# Altium project Monitoring_TECO.PrjPcb
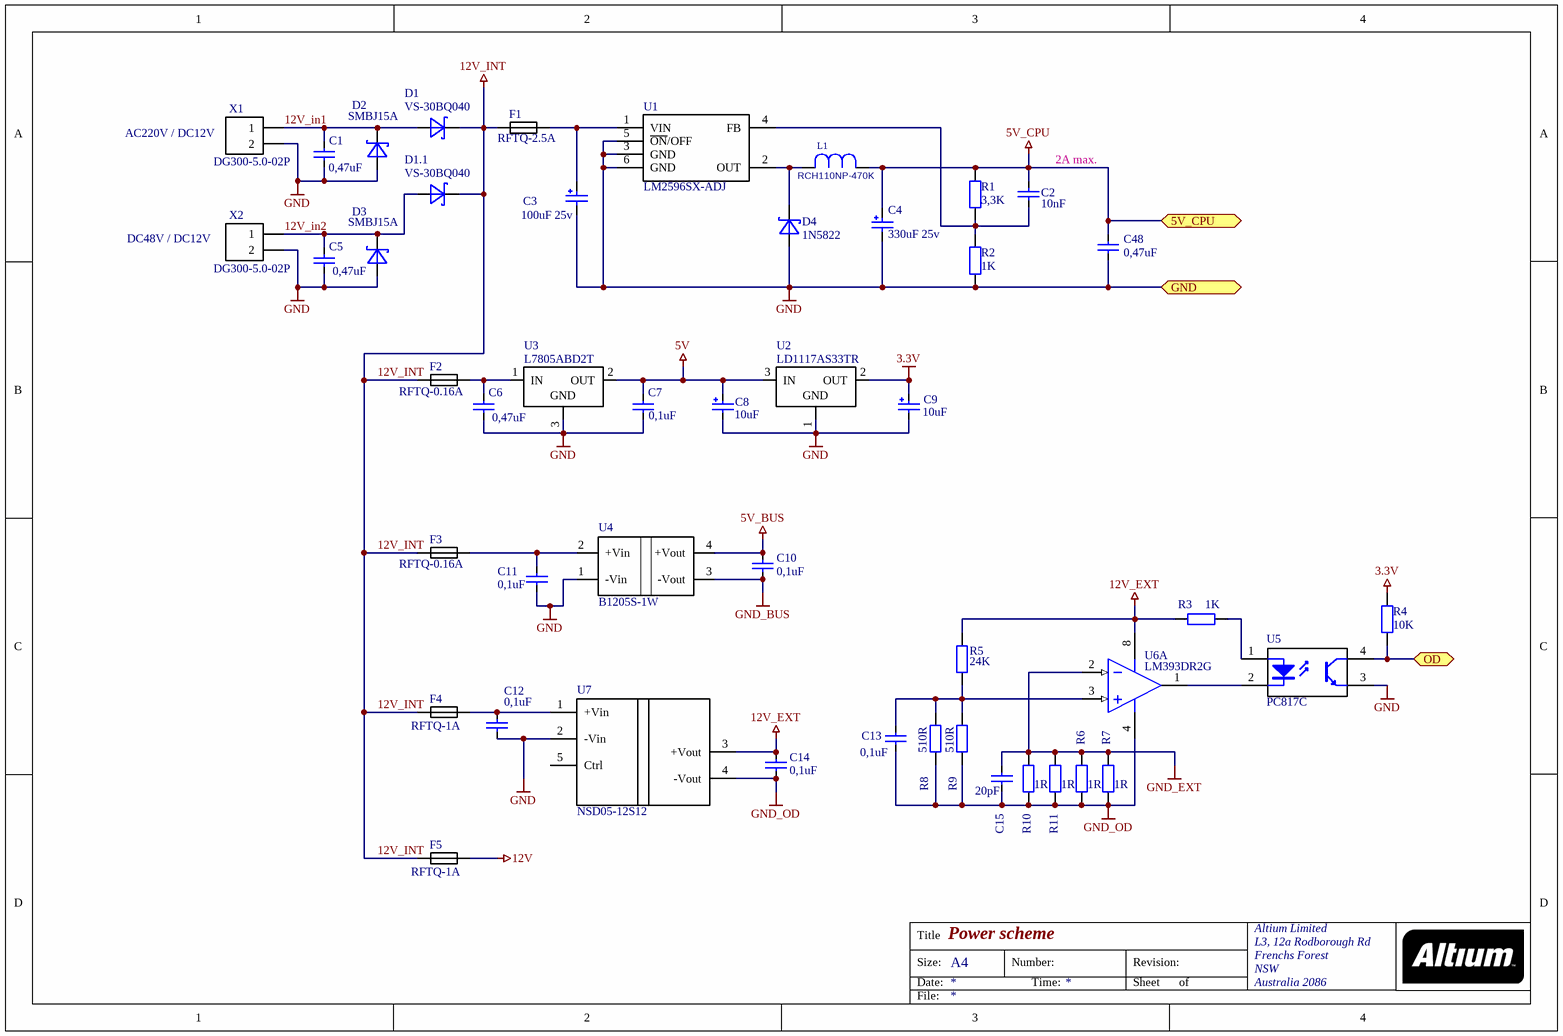
[diagram p0: Sheet_Power.SchDoc]
5 sheets, 222 parts. Net scope: global (net labels, ports and power ports of the same name join across sheets).
Board files: PCB_monitoring_IO.PcbDoc, PCB_monitoring_Top_Front.PcbDoc, PCB_monitoring_Bott_Back.PcbDoc, A10-OLinuXino-LIME.PcbDoc, PCB_monitoring_ConnectA10.PcbDoc
Sheets:
  Sheet_Power.SchDoc
  Sheet_MCU_IO.SchDoc
  Sheet_Top_Front.SchDoc
  Sheet_Bott_Back.SchDoc
  Sheet_ConnectA10.SchDoc

## Sheet Sheet_Power.SchDoc: Power scheme
size A4; Organization: Altium Limited; Address1: L3, 12a Rodborough Rd; Address2: Frenchs Forest; Address3: NSW; Address4: Australia 2086

### Parts
C1  value 0,47uF  [C_1206]  (hidden comment: Cap_Semi)
C2  value 10nF  [C_0805]  (hidden comment: Cap_Semi)
C3  value 100uF 25v  [8x11]  (hidden comment: Cap_Polar)
C4  value 330uF 25v  [10x16]  (hidden comment: Cap_Polar)
C5  value 0,47uF  [C_1206]  (hidden comment: Cap_Semi)
C6  value 0,47uF  [C_1206]  (hidden comment: Cap_Semi)
C7  value 0,1uF  [C_0805]  (hidden comment: Cap_Semi)
C8  value 10uF  [5x11]  (hidden comment: Cap_Polar)
C9  value 10uF  [5x11]  (hidden comment: Cap_Polar)
C10  value 0,1uF  [C_0805]  (hidden comment: Cap_Semi)
C11  value 0,1uF  [C_0805]  (hidden comment: Cap_Semi)
C12  value 0,1uF  [C_0805]  (hidden comment: Cap_Semi)
C13  value 0,1uF  [C_0805]  (hidden comment: Cap_Semi)
C14  value 0,1uF  [C_0805]  (hidden comment: Cap_Semi)
C15  value 20pF  [C_0805]  (hidden comment: Cap_Semi)
C48  value 0,47uF  [C_1206]  (hidden comment: Cap_Semi)
D1  VS-30BQ040  [SMC]
D1.1  VS-30BQ040  [SMC]
D2  SMBJ15A  [SMB]
D3  SMBJ15A  [SMB]
D4  1N5822  [DO-201]
F1  RFTQ-2.5A  [Fuse RFTQ]
F2  RFTQ-0.16A  [Fuse RFTQ]
F3  RFTQ-0.16A  [Fuse RFTQ]
F4  RFTQ-1A  [Fuse RFTQ]
F5  RFTQ-1A  [Fuse RFTQ]
L1  RCH110NP-470K  [RCH-110]
R1  value 3,3K  [R_0805]  (hidden comment: Resistor)
R2  value 1K  [R_0805]  (hidden comment: Resistor)
R3  value 1K  [R_0805]  (hidden comment: Resistor)
R4  value 10K  [R_0805]  (hidden comment: Resistor)
R5  value 24K  [R_0805]  (hidden comment: Resistor)
R6  value 1R  [R_1206]  (hidden comment: Resistor)
R7  value 1R  [R_1206]  (hidden comment: Resistor)
R8  value 510R  [R_0805]  (hidden comment: Resistor)
R9  value 510R  [R_0805]  (hidden comment: Resistor)
R10  value 1R  [R_1206]  (hidden comment: Resistor)
R11  value 1R  [R_1206]  (hidden comment: Resistor)
U1  LM2596SX-ADJ  [D2PAK_5p]
U2  LD1117AS33TR  [SOT-223_N]
U3  L7805ABD2T  [D2PAK_3p]
U4  B1205S-1W  [SIP4]
U5  PC817C  [DIP-4]
U6  LM393DR2G  [SO-8_L]  (part A of 2)
U7  NSD05-12S12  [NSD05]
X1  DG300-5.0-02P  [5mm 2]
X2  DG300-5.0-02P  [5mm 2]

### Ports
5V_CPU, GND, OD

### Nets
3.3V: C9.1 R4.2 U2.2(OUT)
5V: C7.2 C8.1 U2.3(IN) U3.2(OUT)
5V_BUS: C10.1 U4.4(+Vout)
5V_CPU: C2.1 C4.1 C48.2 L1.1 R1.2 ; port 5V_CPU
12V: F5.1
12V_EXT: C14.2 R3.1 R5.2 U6.8(VCC) U7.3(+Vout)
12V_INT: D1.2(C) D1.1.2(C) F1.2 F2.2 F3.2 F4.2 F5.2
GND: C1.1 C3.2 C4.2 C5.1 C6.1 C7.1 C8.2 C9.2 C11.2 C12.1 C48.1 D2.1(A) D3.1(A) D4.1(A) R2.1 U1.3(GND) U1.5(~{ON}/OFF) U1.6(GND) U2.1(GND) U3.3(GND) U4.1(-Vin) U5.3(E) U7.2(-Vin) X1.2 X2.2 ; port GND
GND_BUS: C10.2 U4.3(-Vout)
GND_EXT: C15.2 R6.2 R7.2 R10.2 R11.2 U6.2(INA-)
GND_OD: C13.1 C14.1 C15.1 R6.1 R7.1 R8.1 R9.1 R10.1 R11.1 U6.4(GND) U7.4(-Vout)
12V_in1: C1.2 D1.1(A) D2.2(C) X1.1
12V_in2: C5.2 D1.1.1(A) D3.2(C) X2.1
OD: R4.1 U5.4(C) ; port OD
NetC2_2: C2.2 R1.1 R2.2 U1.4(FB)
NetC3_1: C3.1 F1.1 U1.1(VIN)
NetC6_2: C6.2 F2.1 U3.1(IN)
NetC11_1: C11.1 F3.1 U4.2(+Vin)
NetC12_2: C12.2 F4.1 U7.1(+Vin)
NetC13_2: C13.2 R5.1 R8.2 R9.2 U6.3(INA+)
NetD4_2: D4.2(C) L1.2 U1.2(OUT)
NetR3_2: R3.2 U5.1(A)
NetU5_2: U5.2(K) U6.1(OUTA)

Not connected (* = marked no-connect by the designer): U7 5(Ctrl)

### Notes on the sheet
- (near X1) AC220V / DC12V
- (near C2) 2A max.
- DC48V / DC12V
- Title
- Size:
- Date:
- A4
- Number:
- Time:
- Revision:
- Sheet
- of
- File:

### Library data of the parts
C1 C2 C5-C7 C10-C15 C48 = Cap_Semi: Capacitor semi
C3 C4 = Cap_Polar: Capacitor Polar
C8 C9 = Capacitor Polar
D1 D1.1 = VS-30BQ040: Diode Schottky
D2 D3 = SMBJ13A: Supressor
D4 = 1N5822: Diode Schottky
F1-F5 = Fuse
L1 = Inductor: Value: RCH110NP-470K
U1 = LM2596SX-ADJ: Easy Switcher 3.0A Step-Down Voltage Regulator
U2 = LD1117AS33TR: Voltage Regulators 800mA
U3 = L7805ABD2T: Voltage Regulators
U4 = B0505S-1W: DC/DC converter
U5 = PC817: Optocoupler
U6 = LM393DR2G: Dual Comparators
U7 = NSD05-12S12: DC/DC Regulated Single Output
X1 X2 = DG300_2pin: Connector 5mm

## Sheet Sheet_MCU_IO.SchDoc: MCU and I/O scheme
size A3; Organization: Altium Limited; Address1: L3, 12a Rodborough Rd; Address2: Frenchs Forest; Address3: NSW; Address4: Australia 2086
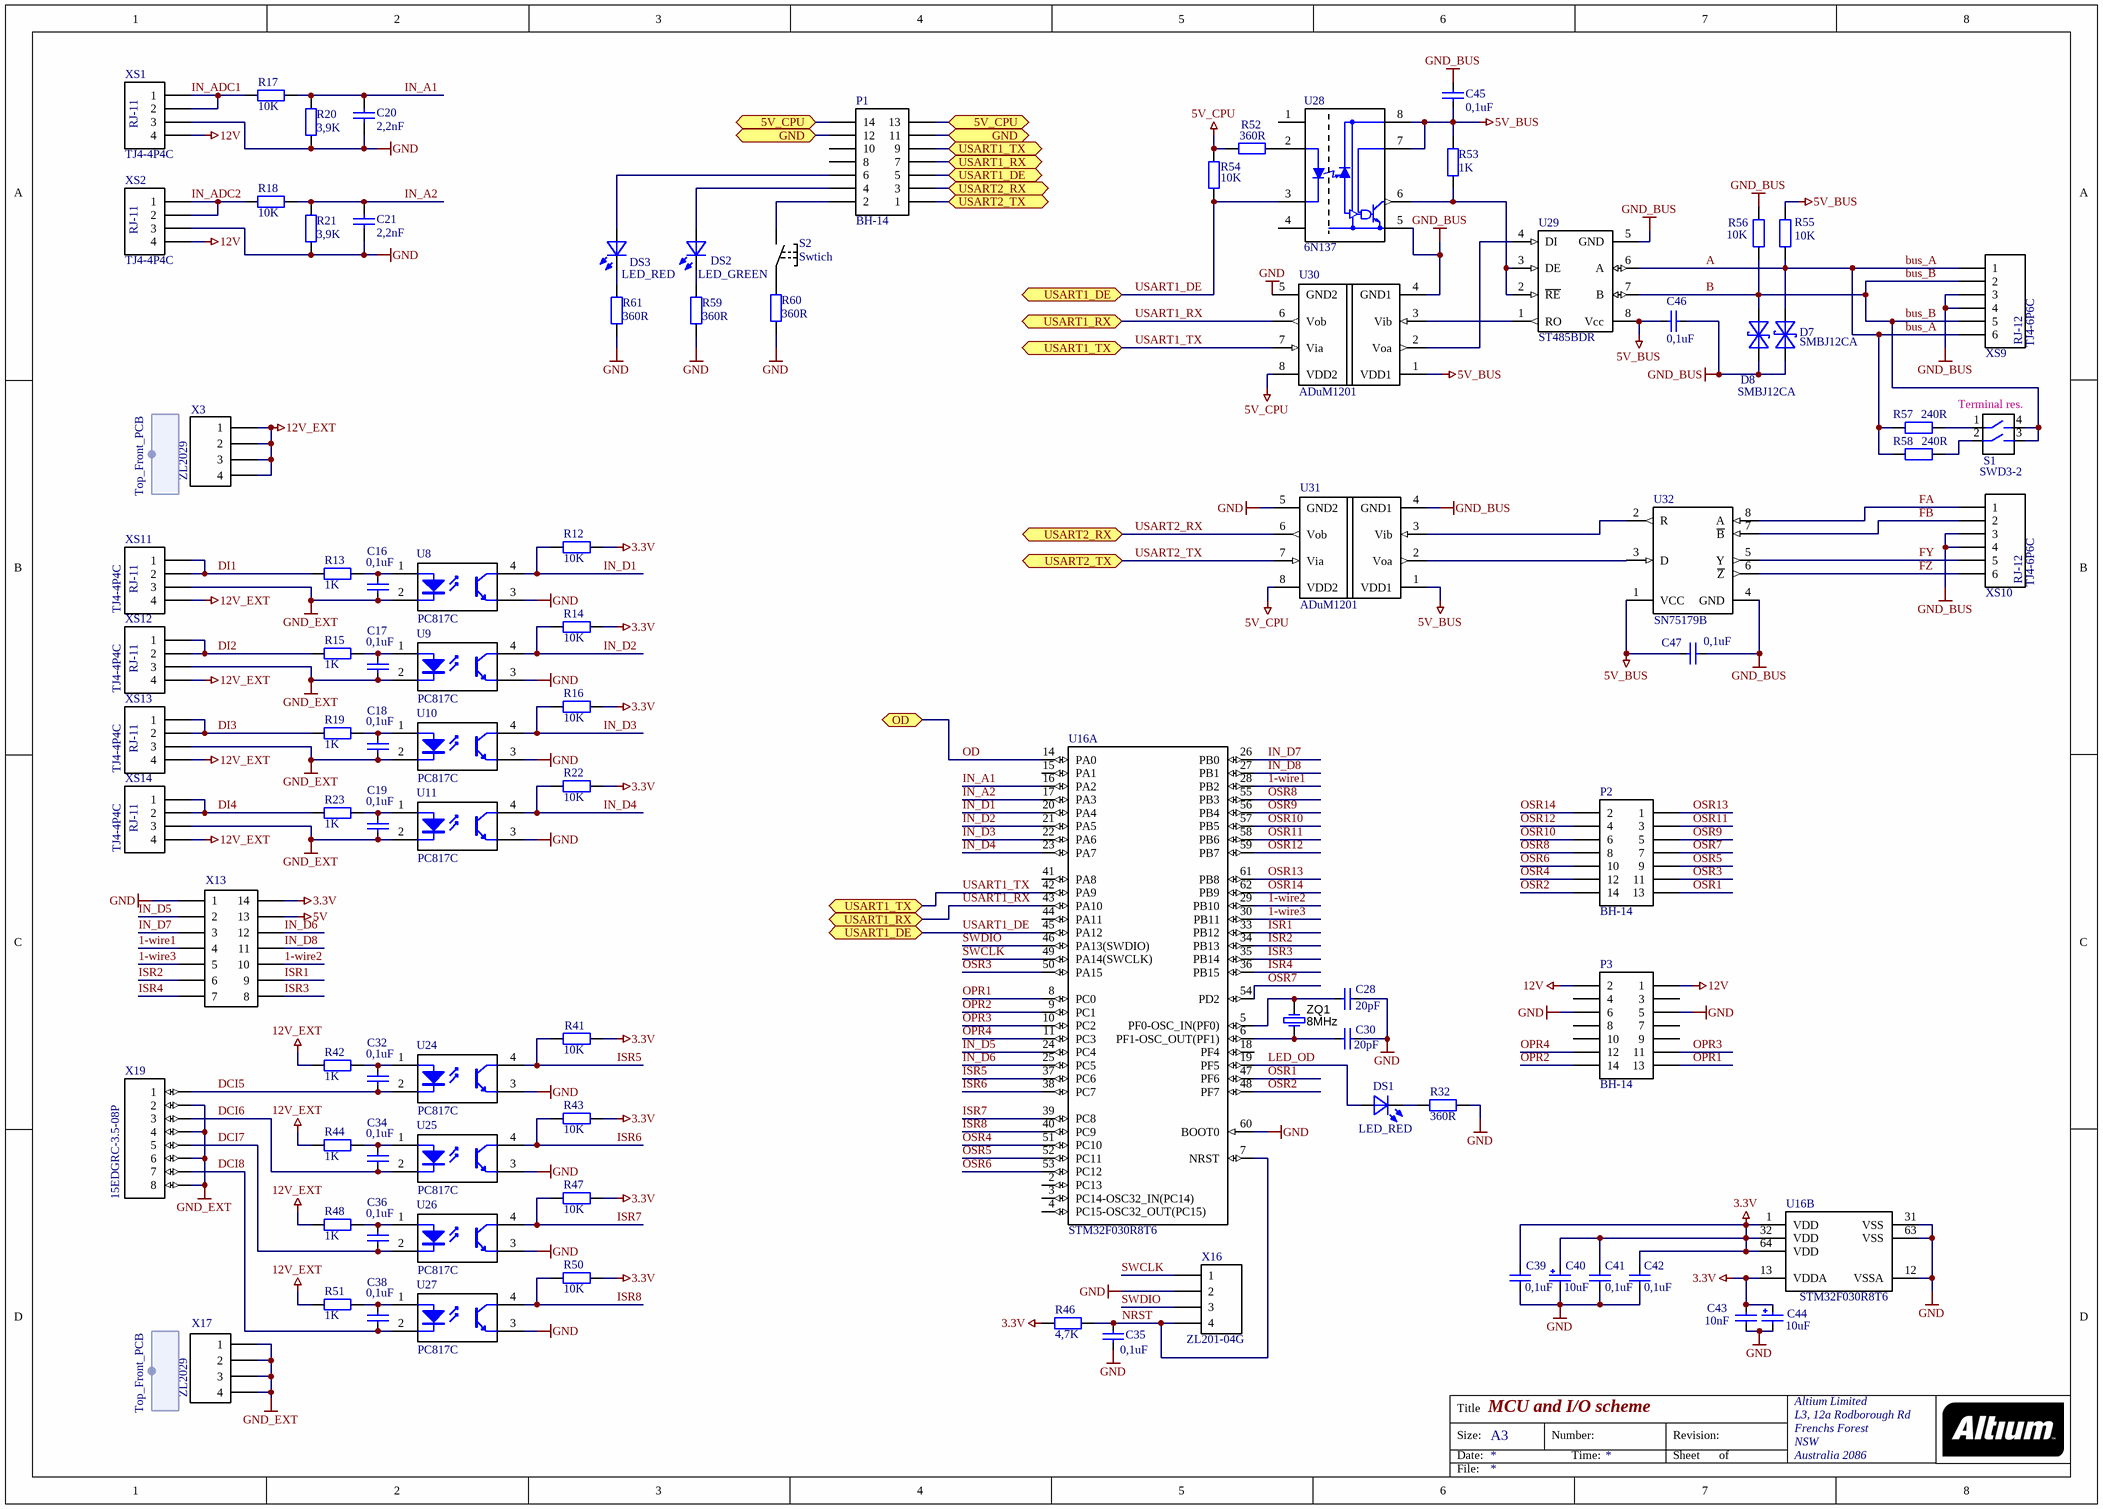
[diagram p1: Sheet_MCU_IO.SchDoc]

### Parts
C16  0,1uF  [C_0805]
C17  0,1uF  [C_0805]
C18  0,1uF  [C_0805]
C19  0,1uF  [C_0805]
C20  value 2,2nF  [C_0805]  (hidden comment: Cap_Semi)
C21  value 2,2nF  [C_0805]  (hidden comment: Cap_Semi)
C28  20pF  [C_0805]
C30  20pF  [C_0805]
C32  0,1uF  [C_0805]
C34  0,1uF  [C_0805]
C35  0,1uF  [C_0805]
C36  0,1uF  [C_0805]
C38  0,1uF  [C_0805]
C39  0,1uF  [C_0805]
C40  10uF  [5x11]
C41  0,1uF  [C_0805]
C42  0,1uF  [C_0805]
C43  10nF  [C_0805]
C44  10uF  [5x11]
C45  0,1uF  [C_0805]
C46  0,1uF  [C_0805]
C47  0,1uF  [C_0805]
D7  SMBJ12CA  [SMB]
D8  SMBJ12CA  [SMB]
DS1  LED_RED  [LED_RED]
DS2  LED_GREEN  [LED_GREEN]
DS3  LED_RED  [LED_RED]
P1  BH-14  [BH-14]
P2  BH-14  [BH-14]
P3  BH-14  [BH-14]
R12  value 10K  [R_0805]  (hidden comment: Resistor)
R13  value 1K  [R_0805]  (hidden comment: Resistor)
R14  value 10K  [R_0805]  (hidden comment: Resistor)
R15  value 1K  [R_0805]  (hidden comment: Resistor)
R16  value 10K  [R_0805]  (hidden comment: Resistor)
R17  value 10K  [R_0805]  (hidden comment: Resistor)
R18  value 10K  [R_0805]  (hidden comment: Resistor)
R19  value 1K  [R_0805]  (hidden comment: Resistor)
R20  value 3,9K  [R_0805]  (hidden comment: Resistor)
R21  value 3,9K  [R_0805]  (hidden comment: Resistor)
R22  value 10K  [R_0805]  (hidden comment: Resistor)
R23  value 1K  [R_0805]  (hidden comment: Resistor)
R32  value 360R  [R_0805]  (hidden comment: Resistor)
R41  value 10K  [R_0805]  (hidden comment: Resistor)
R42  value 1K  [R_0805]  (hidden comment: Resistor)
R43  value 10K  [R_0805]  (hidden comment: Resistor)
R44  value 1K  [R_0805]  (hidden comment: Resistor)
R46  value 4,7K  [R_0805]  (hidden comment: Resistor)
R47  value 10K  [R_0805]  (hidden comment: Resistor)
R48  value 1K  [R_0805]  (hidden comment: Resistor)
R50  value 10K  [R_0805]  (hidden comment: Resistor)
R51  value 1K  [R_0805]  (hidden comment: Resistor)
R52  value 360R  [R_0805]  (hidden comment: Resistor)
R53  value 1K  [R_0805]  (hidden comment: Resistor 0805)
R54  value 10K  [R_0805]  (hidden comment: Resistor)
R55  value 10K  [R_0805]  (hidden comment: Resistor 0805)
R56  value 10K  [R_0805]  (hidden comment: Resistor 0805)
R57  value 240R  [R_1206]  (hidden comment: Resistor 1206)
R58  value 240R  [R_1206]  (hidden comment: Resistor 1206)
R59  value 360R  [R_0805]  (hidden comment: Resistor)
R60  value 360R  [R_0805]  (hidden comment: Resistor)
R61  value 360R  [R_0805]  (hidden comment: Resistor)
S1  SW DIP-2  [Swich_DIP2]  (value not drawn)
S2  Swtich  [Swich_TACTA-68N-F_]
U8  PC817C  [DIP-4]
U9  PC817C  [DIP-4]
U10  PC817C  [DIP-4]
U11  PC817C  [DIP-4]
U16  STM32F030R8T6  [LQFP64_L]  (parts A,B of 2)
U24  PC817C  [DIP-4]
U25  PC817C  [DIP-4]
U26  PC817C  [DIP-4]
U27  PC817C  [DIP-4]
U28  6N137  [DIP-8]
U29  ST485BDR  [SO-8_N]
U30  ADuM1201  [SO-8_N]
U31  ADuM1201  [SO-8_N]
U32  SN75179B  [SO-8_L]
X3  ZL2029  [PLS-4-3D]
X13  PLS2-14  [PLS2-14]  (value not drawn)
X16  PLS-4  [PLS-4-3D]  (value not drawn)
X17  PLS-4  [PLS-4-3D]  (value not drawn)
X19  15EDGRC-3.5-08P  [MC_3.5_8]
XS1  RJ-11  [RJ-11 - TJ4-4P4C]  (value not drawn)
XS2  RJ-11  [RJ-11 - TJ4-4P4C]  (value not drawn)
XS9  RJ-12  [RJ-12 - TJ4-6P6C]  (value not drawn)
XS10  RJ-12  [RJ-12 - TJ4-6P6C]  (value not drawn)
XS11  RJ-11  [RJ-11 - TJ4-4P4C]  (value not drawn)
XS12  RJ-11  [RJ-11 - TJ4-4P4C]  (value not drawn)
XS13  RJ-11  [RJ-11 - TJ4-4P4C]  (value not drawn)
XS14  RJ-11  [RJ-11 - TJ4-4P4C]  (value not drawn)
ZQ1  8MHz  [HC49S_3D]

### Ports
5V_CPU, GND, OD, USART1_DE, USART1_RX, USART1_TX, USART2_RX, USART2_TX

### Harnesses
Top_Front_PCB: 

### Nets
3.3V: C39.1 C40.1 C41.1 C42.1 C43.1 C44.1 R12.1 R14.1 R16.1 R22.1 R41.1 R43.1 R46.1 R47.1 R50.1 U16.1(VDD) U16.13(VDDA) U16.32(VDD) U16.64(VDD) X13.14
5V: X13.13
5V_BUS: C45.1 C46.2 C47.2 R53.2 R55.2 U28.7(Ve) U28.8(Vcc) U29.8(Vcc) U30.1(VDD1) U31.1(VDD1) U32.1(VCC)
5V_CPU: P1.13 P1.14 R52.2 R54.2 U30.8(VDD2) U31.8(VDD2) ; port 5V_CPU
12V: P3.1 P3.2 XS1.4 XS2.4
12V_EXT: R42.2 R44.2 R48.2 R51.2 X3.1 X3.2 X3.3 X3.4 XS11.4 XS12.4 XS13.4 XS14.4
GND: C20.2 C21.2 C28.1 C30.1 C35.2 C39.2 C40.2 C41.2 C42.2 C43.2 C44.2 P1.11 P1.12 P3.5 P3.6 R20.2 R21.2 R32.2 R59.2 R60.2 R61.2 U8.3(E) U9.3(E) U10.3(E) U11.3(E) U16.12(VSSA) U16.31(VSS) U16.60(BOOT0) U16.63(VSS) U24.3(E) U25.3(E) U26.3(E) U27.3(E) U30.5(GND2) U31.5(GND2) X13.1 X16.2 XS1.3 XS2.3 ; port GND
GND_BUS: C45.2 C46.1 C47.1 D7.1(A) D8.2(C) R56.2 U28.5(GND) U29.5(GND) U30.4(GND1) U31.4(GND1) U32.4(GND) XS9.3 XS9.4 XS10.3 XS10.4
GND_EXT: C16.2 C17.2 C18.2 C19.2 U8.2(K) U9.2(K) U10.2(K) U11.2(K) X17.1 X17.2 X17.3 X17.4 X19.2 X19.4 X19.6 X19.8 XS11.3 XS12.3 XS13.3 XS14.3
1-wire1: U16.28(PB2) X13.4
1-wire2: U16.29(PB10) X13.10
1-wire3: U16.30(PB11) X13.5
A: D7.2(C) R55.1 R57.1 R58.1 U29.6(A) XS9.1 XS9.6  [also labelled bus_A]
B: D8.1(A) R56.1 S1.3 S1.4 U29.7(B) XS9.2 XS9.5  [also labelled bus_B]
DCI5: C32.2 U24.2(K) X19.1
DCI6: C34.2 U25.2(K) X19.3
DCI7: C36.2 U26.2(K) X19.5
DCI8: C38.2 U27.2(K) X19.7
DI1: R13.2 XS11.1 XS11.2
DI2: R15.2 XS12.1 XS12.2
DI3: R19.2 XS13.1 XS13.2
DI4: R23.2 XS14.1 XS14.2
FA: U32.8(A) XS10.1
F~{B}: U32.7(~{B}) XS10.2
FY: U32.5(Y) XS10.5
F~{Z}: U32.6(~{Z}) XS10.6
IN_A1: C20.1 R17.1 R20.1 U16.16(PA2)
IN_A2: C21.1 R18.1 R21.1 U16.17(PA3)
IN_ADC1: R17.2 XS1.1 XS1.2
IN_ADC2: R18.2 XS2.1 XS2.2
IN_D1: R12.2 U8.4(C) U16.20(PA4)
IN_D2: R14.2 U9.4(C) U16.21(PA5)
IN_D3: R16.2 U10.4(C) U16.22(PA6)
IN_D4: R22.2 U11.4(C) U16.23(PA7)
IN_D5: U16.24(PC4) X13.2
IN_D6: U16.25(PC5) X13.12
IN_D7: U16.26(PB0) X13.3
IN_D8: U16.27(PB1) X13.11
ISR1: U16.33(PB12) X13.9
ISR2: U16.34(PB13) X13.6
ISR3: U16.35(PB14) X13.8
ISR4: U16.36(PB15) X13.7
ISR5: R41.2 U16.37(PC6) U24.4(C)
ISR6: R43.2 U16.38(PC7) U25.4(C)
ISR7: R47.2 U16.39(PC8) U26.4(C)
ISR8: R50.2 U16.40(PC9) U27.4(C)
LED_OD: DS1.1(A) U16.19(PF5)
NRST: C35.1 R46.2 U16.7(NRST) X16.4
OD: U16.14(PA0) ; port OD
OPR1: P3.13 U16.8(PC0)
OPR2: P3.14 U16.9(PC1)
OPR3: P3.11 U16.10(PC2)
OPR4: P3.12 U16.11(PC3)
OSR1: P2.13 U16.47(PF6)
OSR2: P2.14 U16.48(PF7)
OSR3: P2.11 U16.50(PA15)
OSR4: P2.12 U16.51(PC10)
OSR5: P2.9 U16.52(PC11)
OSR6: P2.10 U16.53(PC12)
OSR7: P2.7 U16.54(PD2)
OSR8: P2.8 U16.55(PB3)
OSR9: P2.5 U16.56(PB4)
OSR10: P2.6 U16.57(PB5)
OSR11: P2.3 U16.58(PB6)
OSR12: P2.4 U16.59(PB7)
OSR13: P2.1 U16.61(PB8)
OSR14: P2.2 U16.62(PB9)
SWCLK: U16.49(PA14(SWCLK)) X16.1
SWDIO: U16.46(PA13(SWDIO)) X16.3
USART1_DE: P1.5 R54.1 U16.45(PA12) U28.3(C) ; port USART1_DE
USART1_RX: P1.7 U16.43(PA10) U30.6(Vob) ; port USART1_RX
USART1_TX: P1.9 U16.42(PA9) U30.7(Via) ; port USART1_TX
USART2_RX: P1.3 U31.6(Vob) ; port USART2_RX
USART2_TX: P1.1 U31.7(Via) ; port USART2_TX
NetC16_1: C16.1 R13.1 U8.1(A)
NetC17_1: C17.1 R15.1 U9.1(A)
NetC18_1: C18.1 R19.1 U10.1(A)
NetC19_1: C19.1 R23.1 U11.1(A)
NetC28_2: C28.2 U16.5(PF0-OSC_IN(PF0)) ZQ1.2(OSC2)
NetC30_2: C30.2 U16.6(PF1-OSC_OUT(PF1)) ZQ1.1(OSC1)
NetC32_1: C32.1 R42.1 U24.1(A)
NetC34_1: C34.1 R44.1 U25.1(A)
NetC36_1: C36.1 R48.1 U26.1(A)
NetC38_1: C38.1 R51.1 U27.1(A)
NetDS1_2: DS1.2(C) R32.1
NetDS2_1: DS2.1(A) P1.4
NetDS2_2: DS2.2(C) R59.1
NetDS3_1: DS3.1(A) P1.6
NetDS3_2: DS3.2(C) R61.1
NetP1_2: P1.2 S2.2(NO)
NetR52_1: R52.1 U28.2(A)
NetR53_1: R53.1 U28.6(Vo) U29.2(~{RE}) U29.3(DE)
NetR57_2: R57.2 S1.1
NetR58_2: R58.2 S1.2
NetR60_1: R60.1 S2.1(COMMON)
NetU29_1: U29.1(RO) U30.3(Vib)
NetU29_4: U29.4(DI) U30.2(Voa)
NetU31_2: U31.2(Voa) U32.3(D)
NetU31_3: U31.3(Vib) U32.2(R)

Not connected (* = marked no-connect by the designer): P1 8 10; P3 3 4 7 8 9 10; U16 2(PC13) 3(PC14-OSC32_IN(PC14)) 4(PC15-OSC32_OUT(PC15)) 15(PA1) 18(PF4) 41(PA8) 44(PA11); U28 1(NC) 4(NC)

### Notes on the sheet
- (near S1) Terminal res.
- Title
- Size:
- Date:
- A3
- Number:
- Time:
- Revision:
- Sheet
- of
- File:
- (in symbol SW DIP-2) SWD3-2

### Library data of the parts
C16-C19 C28 C30 C32 C34-C36 C38 C39 C41-C43 C45-C47 = Cap_Semi: Capacitor semi
C20 C21 = Cap_Semi: Capacitor Semi
C40 C44 = Capacitor Polar
D7 D8 = SMBJ12CA: Supressor
DS1 DS3 = LED_RED: LED
DS2 = LED_GREEN: LED
P1-P3 = BH-14: IDC/BH; LatestRevisionDate: 17-Jul-2002; LatestRevisionNote: Re-released for DXP Platform.; Publisher: Altium Limited
S1 = SW DIP-2: DIP Switch_2
U8-U11 U24-U27 = PC817: Optocoupler
U16 = STM32F030R8T6: ARM Cortex-M0 32-bit MCU, 64 KB Flash, 8 KB Internal RAM, 55 I/Os, 64-pin LQFP, -40 to 85 degC, Tray
U28 = 6N137: Optocoupler
U29 = ST485BDR: RS-485/RS-422 Transceiver
U30 U31 = ADuM1201: Dual-Channel Digital Isolators
U32 = SN75179B: RS485/RS422 Differential driver and receiver pair
X3 = PLS-4: Header, 4-Pin; LatestRevisionDate: 17-Jul-2002; LatestRevisionNote: Re-released for DXP Platform.; Publisher: Altium Limited
X13 = PLS2-14: Header, 14-Pin
X16 = PLS-4: ZL201-04G; LatestRevisionDate: 17-Jul-2002; LatestRevisionNote: Re-released for DXP Platform.; Publisher: Altium Limited
X17 = PLS-4: ZL2029; LatestRevisionDate: 17-Jul-2002; LatestRevisionNote: Re-released for DXP Platform.; Publisher: Altium Limited
X19 = MC_3.5_8: Connector 3.5mm
XS1 XS2 XS11-XS14 = RJ-11: TJ4-4P4C
XS9 XS10 = RJ-12: TJ4-6P6C
ZQ1 = XTAL: Crystal Oscillator; Published: 8-Jun-2000; LatestRevisionDate: 17-Jul-2002; LatestRevisionNote: Re-released for DXP Platform.; PackageReference: R38; Publisher: Altium Limited

## Sheet Sheet_Top_Front.SchDoc: Sheet_Top_Front
size A4; Organization: Altium Limited; Address1: L3, 12a Rodborough Rd; Address2: Frenchs Forest; Address3: NSW; Address4: Australia 2086
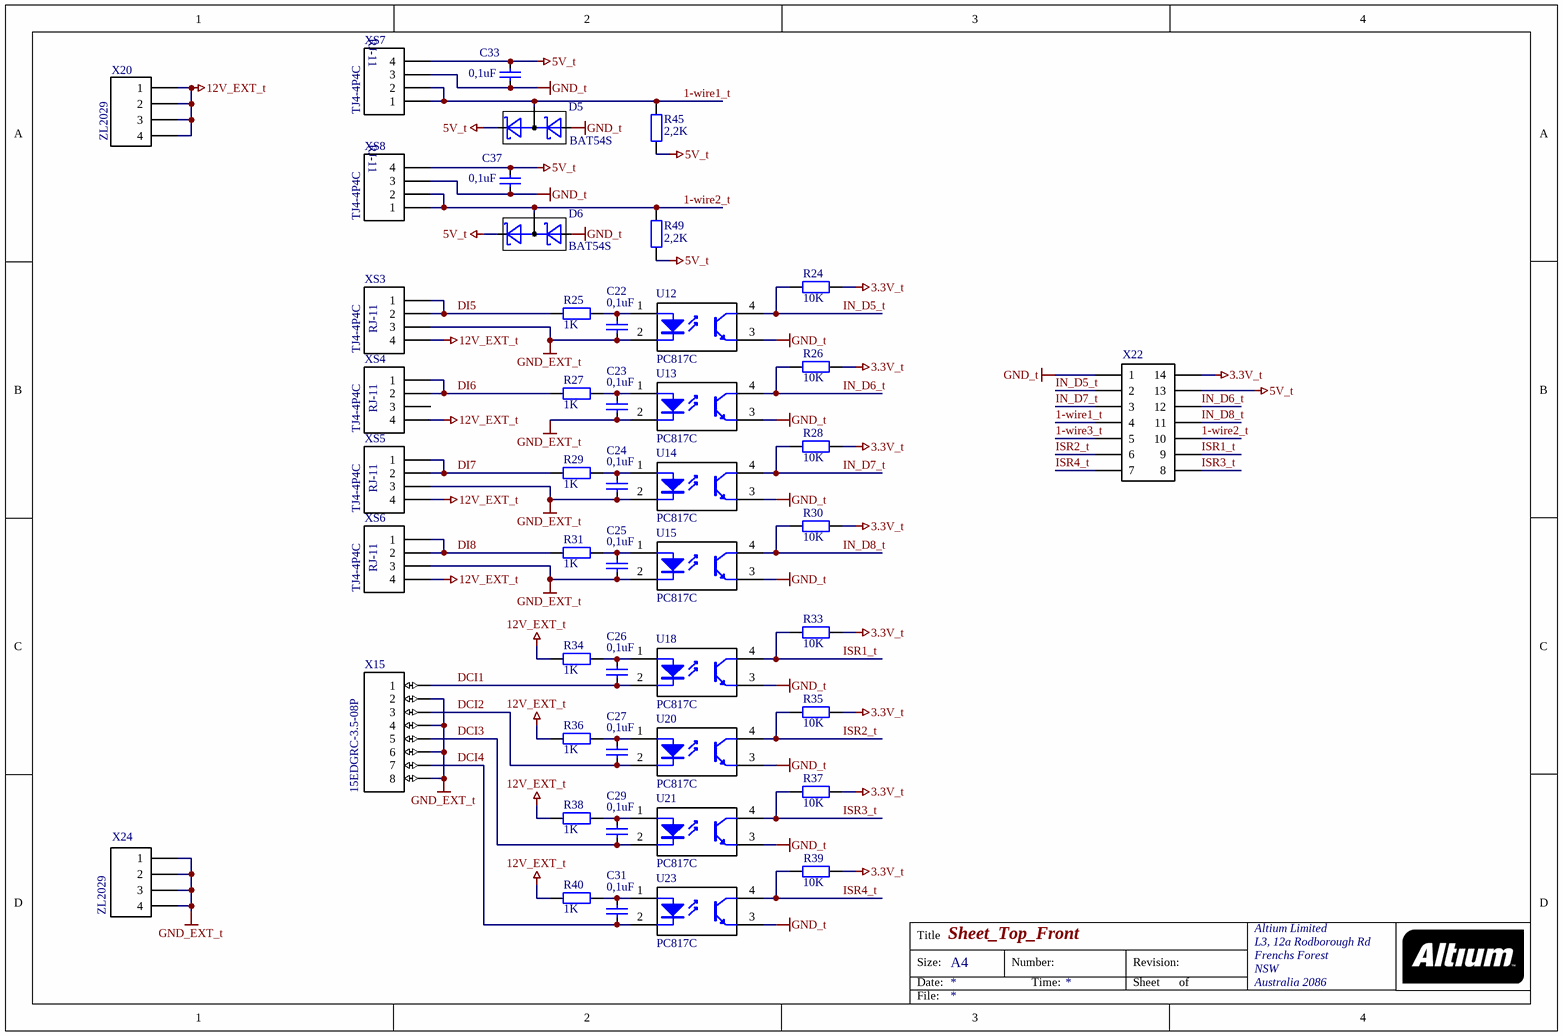
[diagram p2: Sheet_Top_Front.SchDoc]

### Parts
C22  value 0,1uF  [C_0805]  (hidden comment: Cap_Semi)
C23  value 0,1uF  [C_0805]  (hidden comment: Cap_Semi)
C24  value 0,1uF  [C_0805]  (hidden comment: Cap_Semi)
C25  value 0,1uF  [C_0805]  (hidden comment: Cap_Semi)
C26  value 0,1uF  [C_0805]  (hidden comment: Cap_Semi)
C27  value 0,1uF  [C_0805]  (hidden comment: Cap_Semi)
C29  value 0,1uF  [C_0805]  (hidden comment: Cap_Semi)
C31  value 0,1uF  [C_0805]  (hidden comment: Cap_Semi)
C33  value 0,1uF  [C_0805]  (hidden comment: Cap_Semi)
C37  value 0,1uF  [C_0805]  (hidden comment: Cap_Semi)
D5  BAT54S  [SOT-23_d]
D6  BAT54S  [SOT-23_d]
R24  value 10K  [R_0805]  (hidden comment: Resistor)
R25  value 1K  [R_0805]  (hidden comment: Resistor)
R26  value 10K  [R_0805]  (hidden comment: Resistor)
R27  value 1K  [R_0805]  (hidden comment: Resistor)
R28  value 10K  [R_0805]  (hidden comment: Resistor)
R29  value 1K  [R_0805]  (hidden comment: Resistor)
R30  value 10K  [R_0805]  (hidden comment: Resistor)
R31  value 1K  [R_0805]  (hidden comment: Resistor)
R33  value 10K  [R_0805]  (hidden comment: Resistor)
R34  value 1K  [R_0805]  (hidden comment: Resistor)
R35  value 10K  [R_0805]  (hidden comment: Resistor)
R36  value 1K  [R_0805]  (hidden comment: Resistor)
R37  value 10K  [R_0805]  (hidden comment: Resistor)
R38  value 1K  [R_0805]  (hidden comment: Resistor)
R39  value 10K  [R_0805]  (hidden comment: Resistor)
R40  value 1K  [R_0805]  (hidden comment: Resistor)
R45  value 2,2K  [R_0805]  (hidden comment: Resistor)
R49  value 2,2K  [R_0805]  (hidden comment: Resistor)
U12  PC817C  [DIP-4]
U13  PC817C  [DIP-4]
U14  PC817C  [DIP-4]
U15  PC817C  [DIP-4]
U18  PC817C  [DIP-4]
U20  PC817C  [DIP-4]
U21  PC817C  [DIP-4]
U23  PC817C  [DIP-4]
X15  15EDGRC-3.5-08P  [MC_3.5_8]
X20  ZL2029  [PLS-4-3D]
X22  PLS2-14  [PLS2-14]  (value not drawn)
X24  PLS-4  [PLS-4-3D]  (value not drawn)
XS3  RJ-11  [RJ-11 - TJ4-4P4C]  (value not drawn)
XS4  RJ-11  [RJ-11 - TJ4-4P4C]  (value not drawn)
XS5  RJ-11  [RJ-11 - TJ4-4P4C]  (value not drawn)
XS6  RJ-11  [RJ-11 - TJ4-4P4C]  (value not drawn)
XS7  RJ-11  [RJ-11 - TJ4-4P4C]  (value not drawn)
XS8  RJ-11  [RJ-11 - TJ4-4P4C]  (value not drawn)

### Nets
3.3V_t: R24.1 R26.1 R28.1 R30.1 R33.1 R35.1 R37.1 R39.1 X22.14
5V_t: C33.1 C37.1 D5.2(C) D6.2(C) R45.2 R49.2 X22.13 XS7.4 XS8.4
12V_EXT_t: R34.2 R36.2 R38.2 R40.2 X20.1 X20.2 X20.3 X20.4 XS3.4 XS4.4 XS5.4 XS6.4
GND_EXT_t: C22.2 C23.2 C24.2 C25.2 U12.2(K) U13.2(K) U14.2(K) U15.2(K) X15.2 X15.4 X15.6 X15.8 X24.1 X24.2 X24.3 X24.4 XS3.3 XS5.3 XS6.3
GND_t: C33.2 C37.2 D5.1(A) D6.1(A) U12.3(E) U13.3(E) U14.3(E) U15.3(E) U18.3(E) U20.3(E) U21.3(E) U23.3(E) X22.1 XS7.3 XS8.3
1-wire1_t: D5.3(CA) R45.1 X22.4 XS7.1 XS7.2
1-wire2_t: D6.3(CA) R49.1 X22.10 XS8.1 XS8.2
1-wire3_t: X22.5
DCI1: C26.2 U18.2(K) X15.1
DCI2: C27.2 U20.2(K) X15.3
DCI3: C29.2 U21.2(K) X15.5
DCI4: C31.2 U23.2(K) X15.7
DI5: R25.2 XS3.1 XS3.2
DI6: R27.2 XS4.1 XS4.2
DI7: R29.2 XS5.1 XS5.2
DI8: R31.2 XS6.1 XS6.2
IN_D5_t: R24.2 U12.4(C) X22.2
IN_D6_t: R26.2 U13.4(C) X22.12
IN_D7_t: R28.2 U14.4(C) X22.3
IN_D8_t: R30.2 U15.4(C) X22.11
ISR1_t: R33.2 U18.4(C) X22.9
ISR2_t: R35.2 U20.4(C) X22.6
ISR3_t: R37.2 U21.4(C) X22.8
ISR4_t: R39.2 U23.4(C) X22.7
NetC22_1: C22.1 R25.1 U12.1(A)
NetC23_1: C23.1 R27.1 U13.1(A)
NetC24_1: C24.1 R29.1 U14.1(A)
NetC25_1: C25.1 R31.1 U15.1(A)
NetC26_1: C26.1 R34.1 U18.1(A)
NetC27_1: C27.1 R36.1 U20.1(A)
NetC29_1: C29.1 R38.1 U21.1(A)
NetC31_1: C31.1 R40.1 U23.1(A)

Not connected (* = marked no-connect by the designer): XS4 3

### Notes on the sheet
- Title
- Size:
- Date:
- A4
- Number:
- Time:
- Revision:
- Sheet
- of
- File:

### Library data of the parts
C22-C27 C29 C31 C33 C37 = Cap_Semi: Capacitor semi
D5 D6 = BAT54S: Diode Schottky
U12-U15 U18 U20 U21 U23 = PC817: Optocoupler
X15 = MC_3.5_8: Connector 3.5mm
X20 = PLS-4: Header, 4-Pin; LatestRevisionDate: 17-Jul-2002; LatestRevisionNote: Re-released for DXP Platform.; Publisher: Altium Limited
X22 = PLS2-14: Header, 14-Pin
X24 = PLS-4: ZL2029; LatestRevisionDate: 17-Jul-2002; LatestRevisionNote: Re-released for DXP Platform.; Publisher: Altium Limited
XS3-XS8 = RJ-11: TJ4-4P4C

## Sheet Sheet_Bott_Back.SchDoc: Sheet_Bott_Back
size A4; Organization: Altium Limited; Address1: L3, 12a Rodborough Rd; Address2: Frenchs Forest; Address3: NSW; Address4: Australia 2086
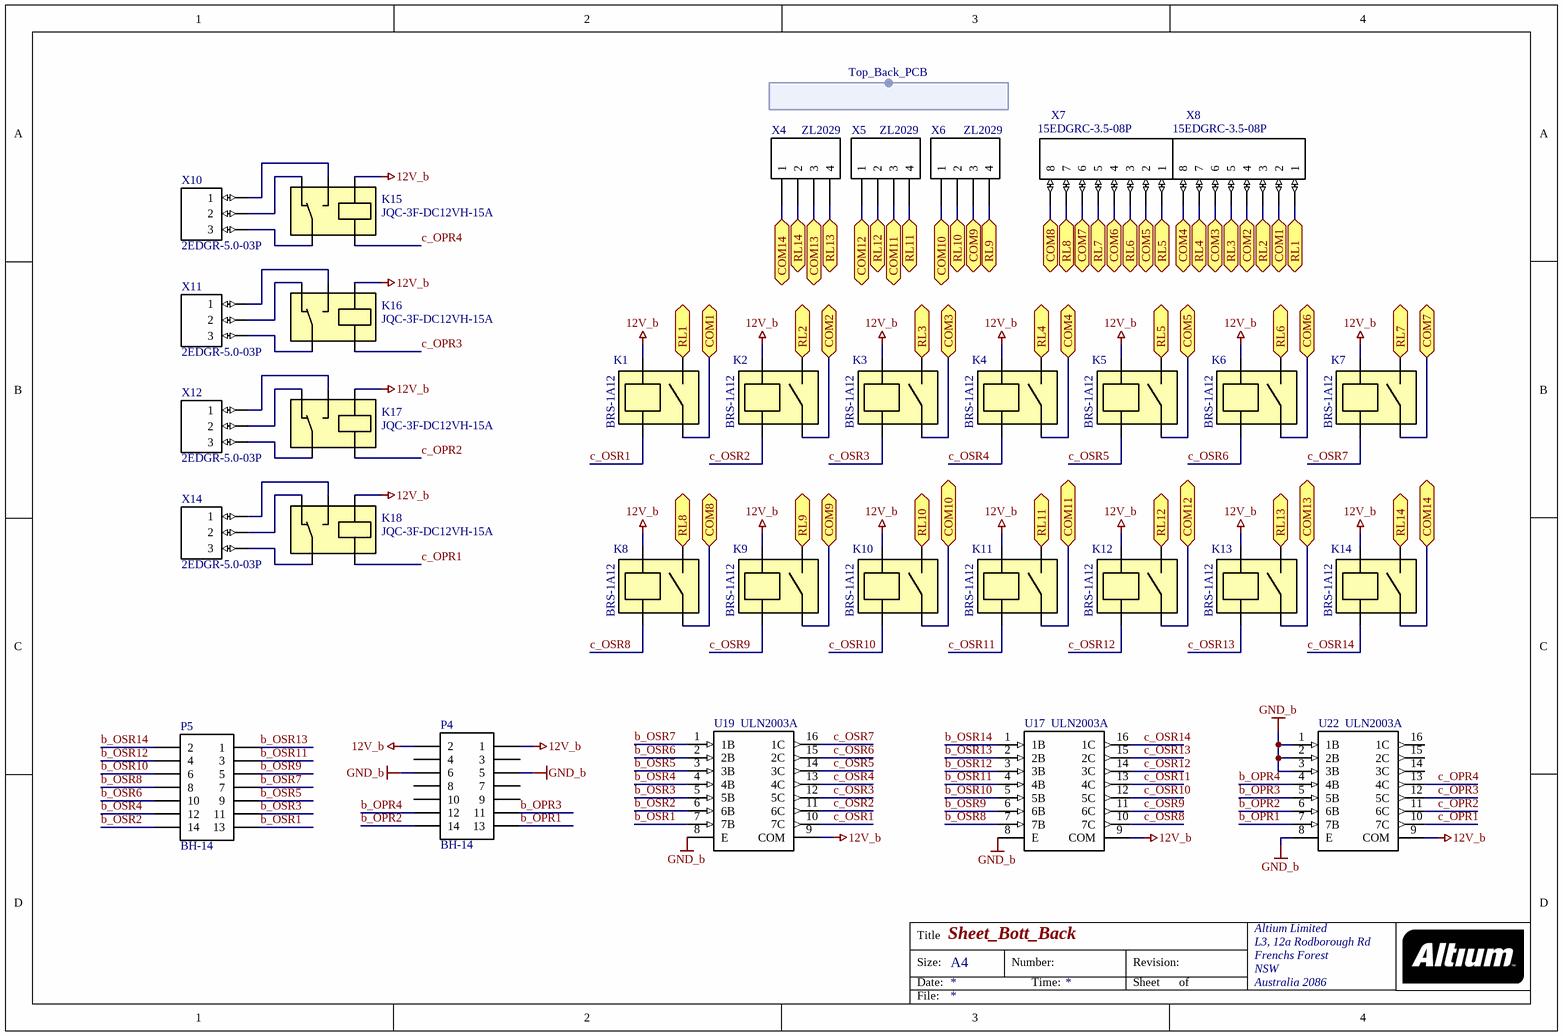
[diagram p3: Sheet_Bott_Back.SchDoc]

### Parts
(Parts that share a designator on the sheet are numbered #1, #2 ... from top to bottom, then left to right.)
K1  BRS-1A12  [R_BRS]
K2  BRS-1A12  [R_BRS]
K3  BRS-1A12  [R_BRS]
K4  BRS-1A12  [R_BRS]
K5  BRS-1A12  [R_BRS]
K6  BRS-1A12  [R_BRS]
K7  BRS-1A12  [R_BRS]
K8  BRS-1A12  [R_BRS]
K9  BRS-1A12  [R_BRS]
K10  BRS-1A12  [R_BRS]
K11  BRS-1A12  [R_BRS]
K12  BRS-1A12  [R_BRS]
K13  BRS-1A12  [R_BRS]
K14  BRS-1A12  [R_BRS]
K15  JQC-3F-DC12VH-15A  [BS-115C-12A]
K16  JQC-3F-DC12VH-15A  [BS-115C-12A]
K17  JQC-3F-DC12VH-15A  [BS-115C-12A]
K18  JQC-3F-DC12VH-15A  [BS-115C-12A]
P4  BH-14  [BH-14]
P5  BH-14  [BH-14]
U17  ULN2003A  [SO-16_N]
U19  ULN2003A  [SO-16_N]
U22  ULN2003A  [SO-16_N]
X4#1  PLS-4  [PLS-4-3D]  (value not drawn)
X5#1  PLS-4  [PLS-4-3D]  (value not drawn)
X6  PLS-4  [PLS-4-3D]  (value not drawn)
X7  15EDGRC-3.5-08P  [MC_3.5_8]
X8  15EDGRC-3.5-08P  [MC_3.5_8]
X10  2EDGR-5.0-03P  [2EDGR-5.0-03P]
X11  2EDGR-5.0-03P  [2EDGR-5.0-03P]
X12  2EDGR-5.0-03P  [2EDGR-5.0-03P]
X14  2EDGR-5.0-03P  [2EDGR-5.0-03P]

### Ports
COM1, COM2, COM3, COM4, COM5, COM6, COM7, COM8, COM9, COM10, COM11, COM12, COM13, COM14, RL1, RL2, RL3, RL4, RL5, RL6, RL7, RL8, RL9, RL10, RL11, RL12, RL13, RL14

### Harnesses
Top_Back_PCB: 

### Nets
12V_b: K1.3 K2.3 K3.3 K4.3 K5.3 K6.3 K7.3 K8.3 K9.3 K10.3 K11.3 K12.3 K13.3 K14.3 K15.1 K16.1 K17.1 K18.1 P4.1 P4.2 U17.9(COM) U19.9(COM) U22.9(COM)
GND_b: P4.5 P4.6 U17.8(E) U19.8(E) U22.1(1B) U22.2(2B) U22.3(3B) U22.8(E)
b_OPR1: P4.13 U22.7(7B)
b_OPR2: P4.14 U22.6(6B)
b_OPR3: P4.11 U22.5(5B)
b_OPR4: P4.12 U22.4(4B)
b_OSR1: P5.13 U19.7(7B)
b_OSR2: P5.14 U19.6(6B)
b_OSR3: P5.11 U19.5(5B)
b_OSR4: P5.12 U19.4(4B)
b_OSR5: P5.9 U19.3(3B)
b_OSR6: P5.10 U19.2(2B)
b_OSR7: P5.7 U19.1(1B)
b_OSR8: P5.8 U17.7(7B)
b_OSR9: P5.5 U17.6(6B)
b_OSR10: P5.6 U17.5(5B)
b_OSR11: P5.3 U17.4(4B)
b_OSR12: P5.4 U17.3(3B)
b_OSR13: P5.1 U17.2(2B)
b_OSR14: P5.2 U17.1(1B)
c_OPR1: K18.2 U22.10(7C)
c_OPR2: K17.2 U22.11(6C)
c_OPR3: K16.2 U22.12(5C)
c_OPR4: K15.2 U22.13(4C)
c_OSR1: K1.5 U19.10(7C)
c_OSR2: K2.5 U19.11(6C)
c_OSR3: K3.5 U19.12(5C)
c_OSR4: K4.5 U19.13(4C)
c_OSR5: K5.5 U19.14(3C)
c_OSR6: K6.5 U19.15(2C)
c_OSR7: K7.5 U19.16(1C)
c_OSR8: K8.5 U17.10(7C)
c_OSR9: K9.5 U17.11(6C)
c_OSR10: K10.5 U17.12(5C)
c_OSR11: K11.5 U17.13(4C)
c_OSR12: K12.5 U17.14(3C)
c_OSR13: K13.5 U17.15(2C)
c_OSR14: K14.5 U17.16(1C)
NetK1_1: K1.1 X8.1 ; port RL1
NetK1_7: K1.7 X8.2 ; port COM1
NetK2_1: K2.1 X8.3 ; port RL2
NetK2_7: K2.7 X8.4 ; port COM2
NetK3_1: K3.1 X8.5 ; port RL3
NetK3_7: K3.7 X8.6 ; port COM3
NetK4_1: K4.1 X8.7 ; port RL4
NetK4_7: K4.7 X8.8 ; port COM4
NetK5_1: K5.1 X7.1 ; port RL5
NetK5_7: K5.7 X7.2 ; port COM5
NetK6_1: K6.1 X7.3 ; port RL6
NetK6_7: K6.7 X7.4 ; port COM6
NetK7_1: K7.1 X7.5 ; port RL7
NetK7_7: K7.7 X7.6 ; port COM7
NetK8_1: K8.1 X7.7 ; port RL8
NetK8_7: K8.7 X7.8 ; port COM8
NetK9_1: K9.1 X6.4 ; port RL9
NetK9_7: K9.7 X6.3 ; port COM9
NetK10_1: K10.1 X6.2 ; port RL10
NetK10_7: K10.7 X6.1 ; port COM10
NetK11_1: K11.1 X5#1.4 ; port RL11
NetK11_7: K11.7 X5#1.3 ; port COM11
NetK12_1: K12.1 X5#1.2 ; port RL12
NetK12_7: K12.7 X5#1.1 ; port COM12
NetK13_1: K13.1 X4#1.4 ; port RL13
NetK13_7: K13.7 X4#1.3 ; port COM13
NetK14_1: K14.1 X4#1.2 ; port RL14
NetK14_7: K14.7 X4#1.1 ; port COM14
NetK15_3: K15.3 X10.3
NetK15_4: K15.4 X10.2
NetK15_5: K15.5 X10.1
NetK16_3: K16.3 X11.3
NetK16_4: K16.4 X11.2
NetK16_5: K16.5 X11.1
NetK17_3: K17.3 X12.3
NetK17_4: K17.4 X12.2
NetK17_5: K17.5 X12.1
NetK18_3: K18.3 X14.3
NetK18_4: K18.4 X14.2
NetK18_5: K18.5 X14.1

Not connected (* = marked no-connect by the designer): P4 3 4 7 8 9 10; U22 14(3C) 15(2C) 16(1C)

### Notes on the sheet
- Title
- Size:
- Date:
- A4
- Number:
- Time:
- Revision:
- Sheet
- of
- File:

### Library data of the parts
K1-K14 = BRS-1A12: 1A, 10Vdc, 1 pole, SIP terminal
K15-K18 = JQC-3F-DC12VH-7A: 7A 240Vac 1 pole Slim relay
P4 P5 = BH-14: IDC/BH; LatestRevisionDate: 17-Jul-2002; LatestRevisionNote: Re-released for DXP Platform.; Publisher: Altium Limited
U17 U19 U22 = ULN2003A: Darlington Transistor Arrays
X4#1 X5#1 X6 = PLS-4: ZL2029; LatestRevisionDate: 17-Jul-2002; LatestRevisionNote: Re-released for DXP Platform.; Publisher: Altium Limited
X7 X8 = MC_3.5_8: Connector 3.5mm
X10-X12 X14 = 2EDGR-5.0-03P: Connector 5mm

## Sheet Sheet_ConnectA10.SchDoc: Sheet_ConnectA10
size A4; Organization: Altium Limited; Address1: L3, 12a Rodborough Rd; Address2: Frenchs Forest; Address3: NSW; Address4: Australia 2086
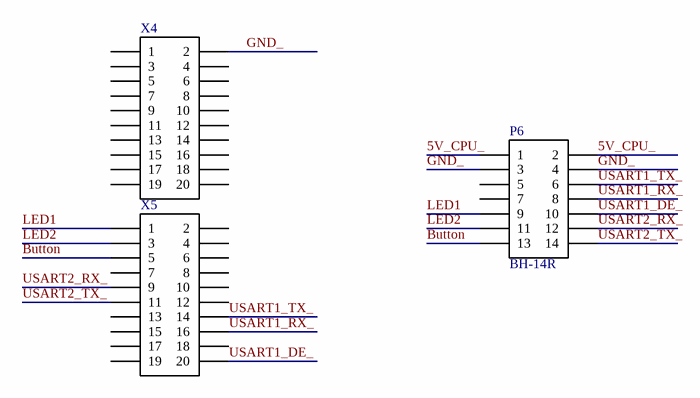
[diagram p4: Sheet_ConnectA10.SchDoc]

### Parts
(Parts that share a designator on the sheet are numbered #1, #2 ... from top to bottom, then left to right.)
P6  BH-14R  [BH-14R]
X4#2  PBD2-20  [PBD2-1.27-20-SMD]  (value not drawn)
X5#2  PBD2-20  [PBD2-1.27-20-SMD]  (value not drawn)

### Nets
5V_CPU_: P6.1 P6.2
Button: P6.13 X5#2.5
GND_: P6.3 P6.4 X4#2.2
LED1: P6.9 X5#2.1
LED2: P6.11 X5#2.3
USART1_DE_: P6.10 X5#2.20
USART1_RX_: P6.8 X5#2.16
USART1_TX_: P6.6 X5#2.14
USART2_RX_: P6.12 X5#2.9
USART2_TX_: P6.14 X5#2.11

Not connected (* = marked no-connect by the designer): P6 5 7; X4#2 1 3 4 5 6 7 8 9 10 11 12 13 14 15 16 17 18 19 20; X5#2 2 4 6 7 8 10 12 13 15 17 18 19

### Notes on the sheet
- Title
- Size:
- Date:
- A4
- Number:
- Time:
- Revision:
- Sheet
- of
- File:

### Library data of the parts
P6 = BH-14: IDC/BH; LatestRevisionDate: 17-Jul-2002; LatestRevisionNote: Re-released for DXP Platform.; Publisher: Altium Limited
X4#2 X5#2 = PBD2-20: Header, 20-Pin

## Nets that join several sheets
3.3V: Sheet_Power (C9.1 R4.2 U2.2), Sheet_MCU_IO (20 pins)
5V: Sheet_Power (C7.2 C8.1 U2.3 U3.2), Sheet_MCU_IO (X13.13)
5V_BUS: Sheet_Power (C10.1 U4.4), Sheet_MCU_IO (11 pins)
5V_CPU: Sheet_Power (5 pins), Sheet_MCU_IO (6 pins)
12V: Sheet_Power (F5.1), Sheet_MCU_IO (P3.1 P3.2 XS1.4 XS2.4)
12V_EXT: Sheet_Power (5 pins), Sheet_MCU_IO (12 pins)
GND: Sheet_Power (25 pins), Sheet_MCU_IO (39 pins)
GND_BUS: Sheet_Power (C10.2 U4.3), Sheet_MCU_IO (15 pins)
GND_EXT: Sheet_Power (6 pins), Sheet_MCU_IO (20 pins)
OD: Sheet_Power (R4.1 U5.4), Sheet_MCU_IO (U16.14)